# Altium schematic sheet Overview.SchDoc
size 431 x 279 mm; SheetNumber: 1; SheetTotal: 13
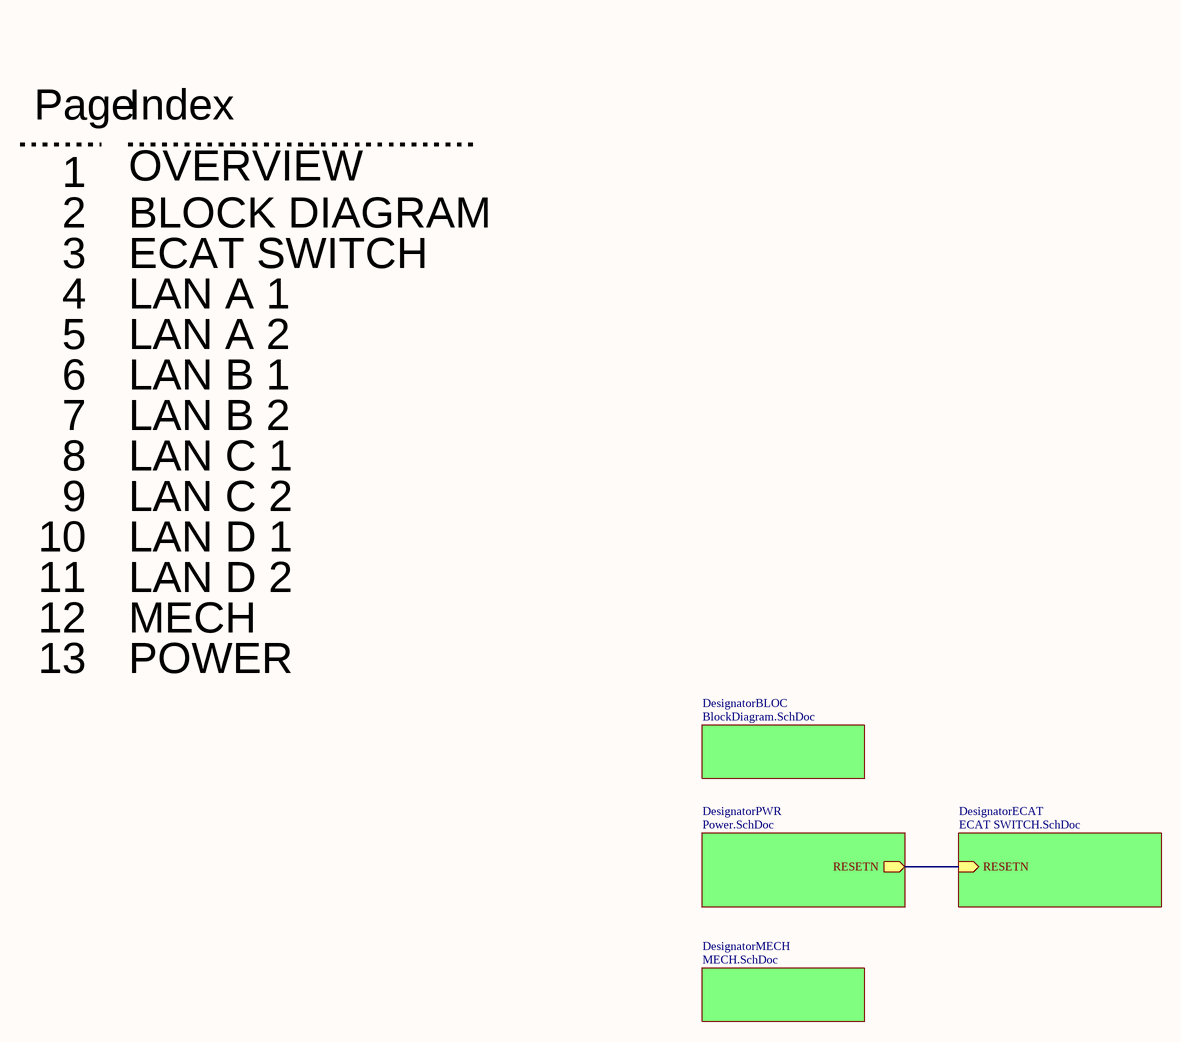
[diagram p0: Overview.SchDoc]

## Sub-sheets
DesignatorBLOC = BlockDiagram.SchDoc: no entries
DesignatorECAT = ECAT SWITCH.SchDoc: RESETN (in)
DesignatorMECH = MECH.SchDoc: no entries
DesignatorPWR = Power.SchDoc: RESETN (out)

## Nets
(unnamed): sheet DesignatorECAT/RESETN, sheet DesignatorPWR/RESETN

## Notes on the sheet
- Page
- Index
- 1
- OVERVIEW
- 2
- 3
- BLOCK DIAGRAM
- ECAT SWITCH
- 4
- 5
- LAN A 1
- LAN A 2
- 6
- LAN B 1
- 7
- 8
- LAN B 2
- LAN C 1
- 9
- 10
- LAN C 2
- LAN D 1
- 11
- LAN D 2
- 12
- 13
- POWER
- MECH
- REVISION
- DESCRIPTION
- DATE
- DESIGNED:
- CHECKED:
- TITLE:
- FILE NAME:
- CUR REV:
- PCB:
- SHEET:
- DATE:
- OF